# Altium schematic sheet wisp-6-peripherals.SchDoc: Peripherals
size B; SheetNumber: 4; SheetTotal: 4
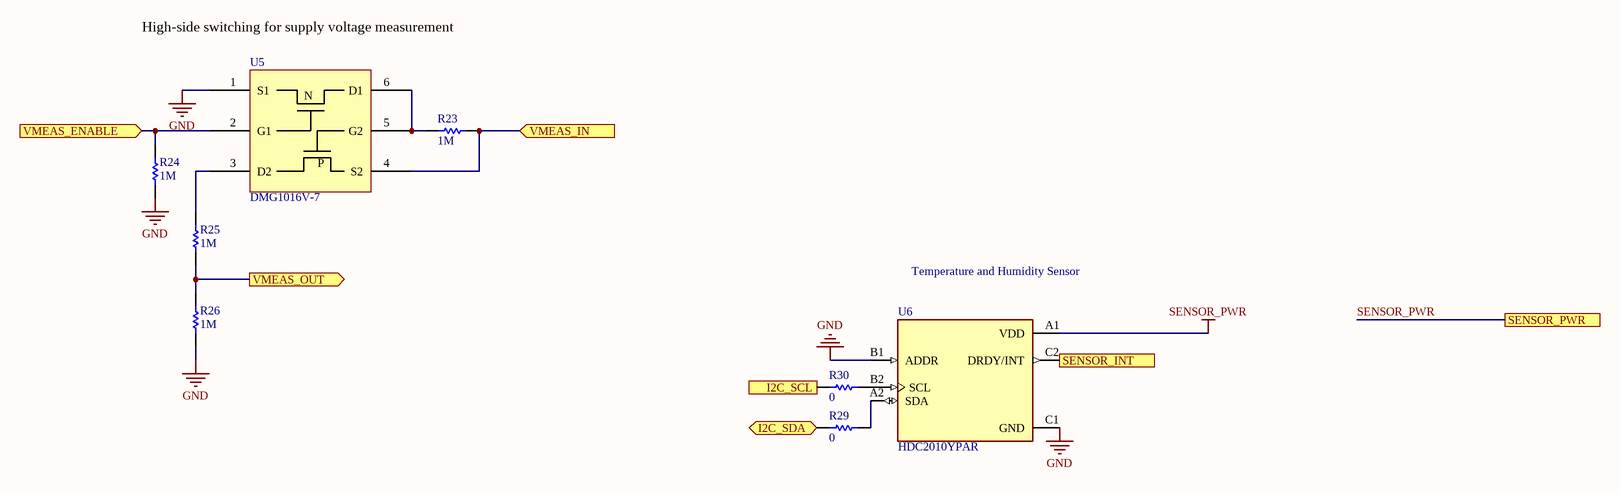
[diagram p0: wisp-6-peripherals.SchDoc]

## Parts
R23  value 1M  [0402]  (hidden comment: Generic resistor)
R24  value 1M  [0402]  (hidden comment: Generic resistor)
R25  value 1M  [0402]  (hidden comment: Generic resistor)
R26  value 1M  [0402]  (hidden comment: Generic resistor)
R29  value 0  [0402]  (hidden comment: Generic resistor)
R30  value 0  [0402]  (hidden comment: Generic resistor)
U5  DMG1016V-7  [SOT-563 Diodes Incorporated]
U6  HDC2010YPAR  [BGA6C100X50P2X3_HDC2010YPAR]

## Ports
I2C_SCL (in), I2C_SDA (bidir), SENSOR_INT (out), SENSOR_PWR, VMEAS_ENABLE (in), VMEAS_IN (in), VMEAS_OUT (out)

## Nets
GND: R24.1 R26.1 U5.1(S1) U6.B1(ADDR) U6.C1(GND)
SENSOR_PWR: U6.A1(VDD) ; port SENSOR_PWR
I2C_SCL: R30.1 ; port I2C_SCL
I2C_SDA: R29.1 ; port I2C_SDA
SENSOR_INT: U6.C2(DRDY/INT) ; port SENSOR_INT
VMEAS_ENABLE: R24.2 U5.2(G1) ; port VMEAS_ENABLE
VMEAS_IN: R23.2 U5.4(S2) ; port VMEAS_IN
VMEAS_OUT: R25.1 R26.2 ; port VMEAS_OUT
NetR23_1: R23.1 U5.5(G2) U5.6(D1)
NetR25_2: R25.2 U5.3(D2)
NetR29_2: R29.2 U6.A2(SDA)
NetR30_2: R30.2 U6.B2(SCL)

## Notes on the sheet
- High-side switching for supply voltage measurement
- Temperature and Humidity Sensor
- (in symbol DMG1016V-7) N; P

## Library data of the parts
R23-R26 = R-1M-0.063W-5%-0402: RES 1M OHM 5% 1/16W 0402; Manufacturer: YAGEO; Manufacturer Part Number: RC0402JR-071ML; Tolerance: +-5%; Digi-Key Part Number: 311-1.0MJRCT-ND; Rating: 1/16W; Note: *
R29 R30 = R-0-0.063W-*-0402: RES 0 OHM JUMPER 1/16W 0402; Manufacturer: YAGEO; Manufacturer Part Number: RC0402JR-070RL; Digi-Key Part Number: 311-0.0JRCT-ND; Rating: 1/16W; Note: *; Tolerance: *
U5 = DMG1016V-7: MOSFET N/P-CH 20V 0.87A SOT563; Manufacturer: Diodes Incorporated; Rating: 530mW, -55~150C; Digi-Key Part Number: DMG1016V-7DICT-ND; Manufacturer Part Number: DMG1016V-7; Tolerance: *; Note: *
U6 = HDC2010YPAR: Humidity, Temperature 0 ~ 100% RH I2C ±2% 8 s Surface Mount; Manufacturer: Texas Instruments; Rating: -40~85C; Manufacturer Part Number: HDC2010YPAR; Value: *; Digi-Key Part Number: 296-47774-1-ND; Note: *